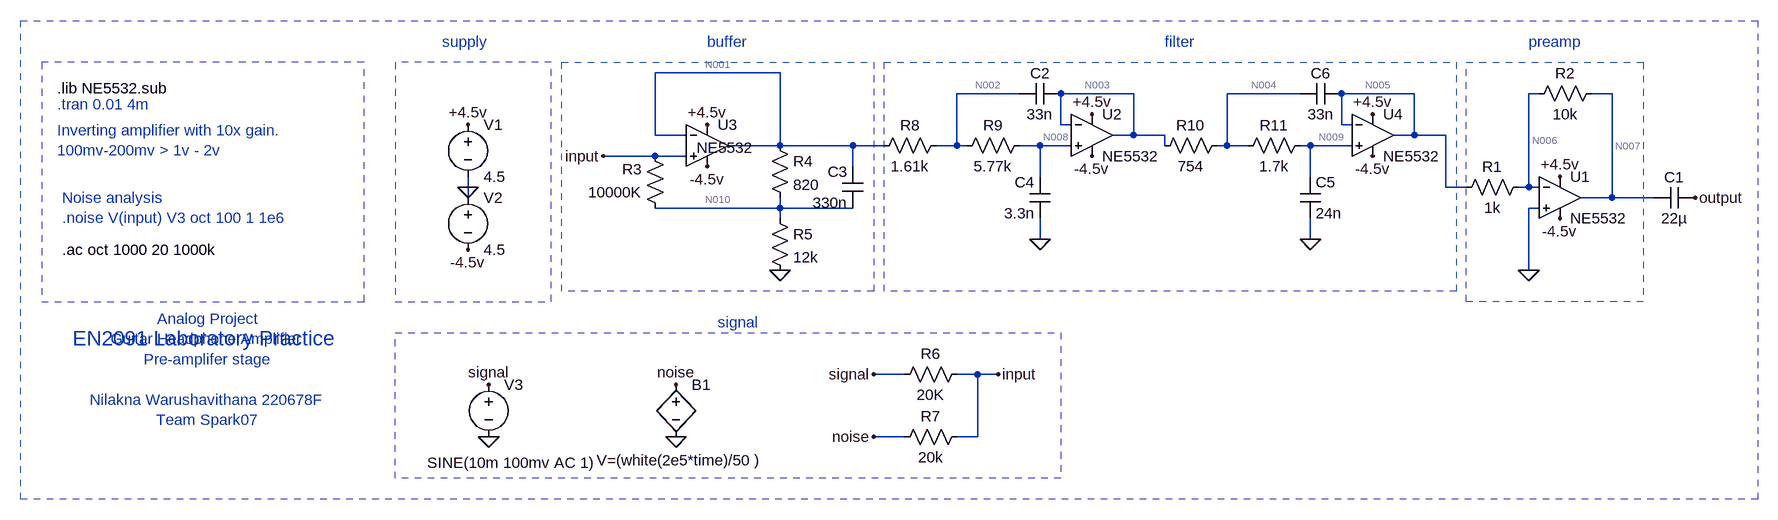
[diagram p0: schematic opamp_input_buffer_filter_preamp-lownoise.asc]
opamp_input_buffer_filter_preamp-lownoise.asc, the LTspice schematic file:
Version 4
SHEET 1 2132 680
WIRE 304 -16 112 -16
WIRE 672 16 576 16
WIRE 848 16 736 16
WIRE 1104 16 992 16
WIRE 1280 16 1168 16
WIRE 1472 16 1456 16
WIRE 1584 16 1552 16
WIRE 736 64 736 16
WIRE 752 64 736 64
WIRE 1168 64 1168 16
WIRE 1184 64 1168 64
WIRE 112 80 112 -16
WIRE 160 80 112 80
WIRE 848 80 848 16
WIRE 848 80 816 80
WIRE 896 80 848 80
WIRE 1280 80 1280 16
WIRE 1280 80 1248 80
WIRE 1328 80 1280 80
WIRE 304 96 304 -16
WIRE 304 96 224 96
WIRE 416 96 304 96
WIRE 464 96 416 96
WIRE 576 96 576 16
WIRE 576 96 544 96
WIRE 592 96 576 96
WIRE 704 96 672 96
WIRE 752 96 704 96
WIRE 896 96 896 80
WIRE 992 96 992 16
WIRE 992 96 976 96
WIRE 1024 96 992 96
WIRE 1120 96 1104 96
WIRE 1184 96 1120 96
WIRE 112 112 32 112
WIRE 160 112 112 112
WIRE 416 128 416 96
WIRE 704 144 704 96
WIRE 1120 144 1120 96
WIRE -176 160 -176 144
WIRE 1328 160 1328 80
WIRE 1360 160 1328 160
WIRE 1456 160 1456 16
WIRE 1456 160 1440 160
WIRE 1472 160 1456 160
WIRE -176 176 -176 160
WIRE 1584 176 1584 16
WIRE 1584 176 1536 176
WIRE 1648 176 1584 176
WIRE 304 192 304 176
WIRE 304 192 112 192
WIRE 416 192 304 192
WIRE 1472 192 1456 192
WIRE 304 208 304 192
WIRE 704 240 704 208
WIRE 1120 240 1120 208
WIRE 1456 288 1456 192
WIRE 496 448 448 448
WIRE 608 448 576 448
WIRE 640 448 608 448
WIRE 496 544 448 544
WIRE 608 544 608 448
WIRE 608 544 576 544
FLAG -176 160 0
FLAG -176 64 +4.5v
FLAG 1504 144 +4.5v
FLAG 1504 208 -4.5v
FLAG -176 256 -4.5v
FLAG -144 544 0
FLAG -144 464 signal
FLAG 32 112 input
FLAG 1456 288 0
FLAG 1712 176 output
FLAG 144 544 0
FLAG 144 464 noise
FLAG 448 448 signal
FLAG 448 544 noise
FLAG 640 448 input
FLAG 192 64 +4.5v
FLAG 192 128 -4.5v
FLAG 304 288 0
FLAG 704 240 0
FLAG 1120 240 0
FLAG 784 48 +4.5v
FLAG 1216 48 +4.5v
FLAG 1216 112 -4.5v
FLAG 784 112 -4.5v
SYMBOL OpAmps\\opamp2 1504 112 R0
SYMATTR InstName U1
SYMATTR Value NE5532
SYMBOL voltage -176 48 R0
WINDOW 123 0 0 Left 0
WINDOW 39 0 0 Left 0
SYMATTR InstName V1
SYMATTR Value 4.5
SYMBOL voltage -176 160 R0
WINDOW 123 0 0 Left 0
WINDOW 39 0 0 Left 0
SYMATTR InstName V2
SYMATTR Value 4.5
SYMBOL voltage -144 448 R0
WINDOW 3 -95 136 Left 2
WINDOW 123 0 0 Left 0
WINDOW 39 0 0 Left 0
SYMATTR Value SINE(10m 100mv AC 1)
SYMATTR InstName V3
SYMBOL res 1456 144 R90
WINDOW 0 0 56 VBottom 2
WINDOW 3 32 56 VTop 2
SYMATTR InstName R1
SYMATTR Value 1k
SYMBOL res 1568 0 R90
WINDOW 0 0 56 VBottom 2
WINDOW 3 32 56 VTop 2
SYMATTR InstName R2
SYMATTR Value 10k
SYMBOL cap 1712 160 R90
WINDOW 0 0 32 VBottom 2
WINDOW 3 32 32 VTop 2
SYMATTR InstName C1
SYMATTR Value 22µ
SYMBOL res 128 208 R180
WINDOW 0 36 76 Left 2
WINDOW 3 36 40 Left 2
SYMATTR InstName R3
SYMATTR Value 10000K
SYMBOL bv 144 448 R0
WINDOW 3 -122 132 Left 2
SYMATTR Value V=(white(2e5*time)/50 )
SYMATTR InstName B1
SYMBOL res 592 432 R90
WINDOW 0 0 56 VBottom 2
WINDOW 3 32 56 VTop 2
SYMATTR InstName R6
SYMATTR Value 20K
SYMBOL res 592 528 R90
WINDOW 0 0 56 VBottom 2
WINDOW 3 32 56 VTop 2
SYMATTR InstName R7
SYMATTR Value 20k
SYMBOL OpAmps\\opamp2 192 32 R0
WINDOW 3 -16 67 Left 2
SYMATTR Value NE5532
SYMATTR InstName U3
SYMBOL cap 432 192 R180
WINDOW 0 24 56 Left 2
WINDOW 3 24 8 Left 2
SYMATTR InstName C3
SYMATTR Value 330n
SYMBOL res 288 80 R0
SYMATTR InstName R4
SYMATTR Value 820
SYMBOL res 288 192 R0
SYMATTR InstName R5
SYMATTR Value 12k
SYMBOL OpAmps\\opamp2 784 16 R0
SYMATTR InstName U2
SYMATTR Value NE5532
SYMBOL OpAmps\\opamp2 1216 16 R0
SYMATTR InstName U4
SYMATTR Value NE5532
SYMBOL res 560 80 R90
WINDOW 0 0 56 VBottom 2
WINDOW 3 32 56 VTop 2
SYMATTR InstName R8
SYMATTR Value 1.61k
SYMBOL res 688 80 R90
WINDOW 0 0 56 VBottom 2
WINDOW 3 32 56 VTop 2
SYMATTR InstName R9
SYMATTR Value 5.77k
SYMBOL cap 736 0 R90
WINDOW 0 0 32 VBottom 2
WINDOW 3 32 32 VTop 2
SYMATTR InstName C2
SYMATTR Value 33n
SYMBOL cap 720 208 R180
WINDOW 0 24 56 Left 2
WINDOW 3 24 8 Left 2
SYMATTR InstName C4
SYMATTR Value 3.3n
SYMBOL res 992 80 R90
WINDOW 0 0 56 VBottom 2
WINDOW 3 32 56 VTop 2
SYMATTR InstName R10
SYMATTR Value 754
SYMBOL res 1120 80 R90
WINDOW 0 0 56 VBottom 2
WINDOW 3 32 56 VTop 2
SYMATTR InstName R11
SYMATTR Value 1.7k
SYMBOL cap 1104 144 R0
SYMATTR InstName C5
SYMATTR Value 24n
SYMBOL cap 1168 0 R90
WINDOW 0 0 32 VBottom 2
WINDOW 3 32 32 VTop 2
SYMATTR InstName C6
SYMATTR Value 33n
TEXT -808 8 Left 2 !.lib NE5532.sub
TEXT -808 32 Left 2 ;.tran 0.01 4m
TEXT -808 72 Left 2 ;Inverting amplifier with 10x gain.\n100mv-200mv > 1v - 2v
TEXT 192 -64 Left 2 ;buffer
TEXT 1456 -64 Left 2 ;preamp
TEXT -216 -64 Left 2 ;supply
TEXT 208 368 Left 2 ;signal
TEXT -784 392 Left 3 ;EN2091 Laboratory Practice
TEXT -576 440 Center 2 ;Analog Project\nGuitar Headphone Amplifier\nPre-amplifer stage\n \nNilakna Warushavithana 220678F\nTeam Spark07
TEXT -800 176 Left 2 ;Noise analysis\n.noise V(input) V3 oct 100 1 1e6
TEXT -800 256 Left 2 !.ac oct 1000 20 1000k
TEXT 896 -64 Left 2 ;filter
RECTANGLE Normal 1632 336 1360 -32 2
RECTANGLE Normal -48 -32 -288 336 2
RECTANGLE Normal 736 608 -288 384 2
RECTANGLE Normal -832 336 -336 -32 2
RECTANGLE Normal 448 320 -32 -32 2
RECTANGLE Normal 1344 320 464 -32 2
RECTANGLE Normal 1808 640 -864 -96 2

The netlist it stands for:
* opamp_input_buffer_filter_preamp-lownoise.asc
XU1 0 N006 +4.5v -4.5v N007 NE5532  ; pins In+ In- V+ V- OUT
V1 +4.5v 0 4.5
V2 0 -4.5v 4.5
V3 signal 0 SINE(10m 100mv AC 1)
R1 N006 N005 1k
R2 N007 N006 10k
C1 output N007 22µ
R3 N010 input 10000K
B1 noise 0 V=(white(2e5*time)/50 )
R6 input signal 20K
R7 input noise 20k
XU3 input N001 +4.5v -4.5v N001 NE5532  ; pins In+ In- V+ V- OUT
C3 N010 N001 330n
R4 N001 N010 820
R5 N010 0 12k
XU2 N008 N003 +4.5v -4.5v N003 NE5532  ; pins In+ In- V+ V- OUT
XU4 N009 N005 +4.5v -4.5v N005 NE5532  ; pins In+ In- V+ V- OUT
R8 N002 N001 1.61k
R9 N008 N002 5.77k
C2 N003 N002 33n
C4 0 N008 3.3n
R10 N004 N003 754
R11 N009 N004 1.7k
C5 N009 0 24n
C6 N005 N004 33n
.lib NE5532.sub
* .tran 0.01 4m
* Inverting amplifier with 10x gain.
* 100mv-200mv > 1v - 2v
* buffer
* preamp
* supply
* signal
* EN2091 Laboratory Practice
* Analog Project
* Guitar Headphone Amplifier
* Pre-amplifer stage
* Nilakna Warushavithana 220678F
* Team Spark07
* Noise analysis
* .noise V(input) V3 oct 100 1 1e6
.ac oct 1000 20 1000k
* filter
.backanno
.end

* Results of the author's LTspice run, read from the files saved beside the schematic
* Operating Point, zero values left out:
*   V(n007) = 53.68 mV
*   V(-4.5v) = -4.5 V
*   V(+4.5v) = 4.5 V
*   V(n006) = 6.189 µV
*   V(signal) = 10 mV
*   V(n005) = -4.862 mV
*   V(output) = 1.181 µV
*   V(n010) = 22.39 µV
*   V(input) = 17.19 µV
*   V(n001) = 23.92 µV
*   V(n003) = -3.647 mV
*   V(n008) = -3.653 mV
*   V(n009) = -4.869 mV
*   V(n002) = -778.3 µV
*   V(n004) = -4.022 mV
*   I(B1) = 859.4 pA
*   I(R1) = 4.869 µA
*   I(R2) = 5.367 µA
*   I(R6) = -499.1 nA
*   I(R7) = 859.4 pA
*   I(R4) = 1.866 nA
*   I(R5) = 1.866 nA
*   I(R8) = -498.3 nA
*   I(R9) = -498.3 nA
*   I(R10) = -498.3 nA
*   I(R11) = -498.3 nA
*   I(V1) = -5.167 mA
*   I(V2) = -5.173 mA
*   I(V3) = -499.1 nA